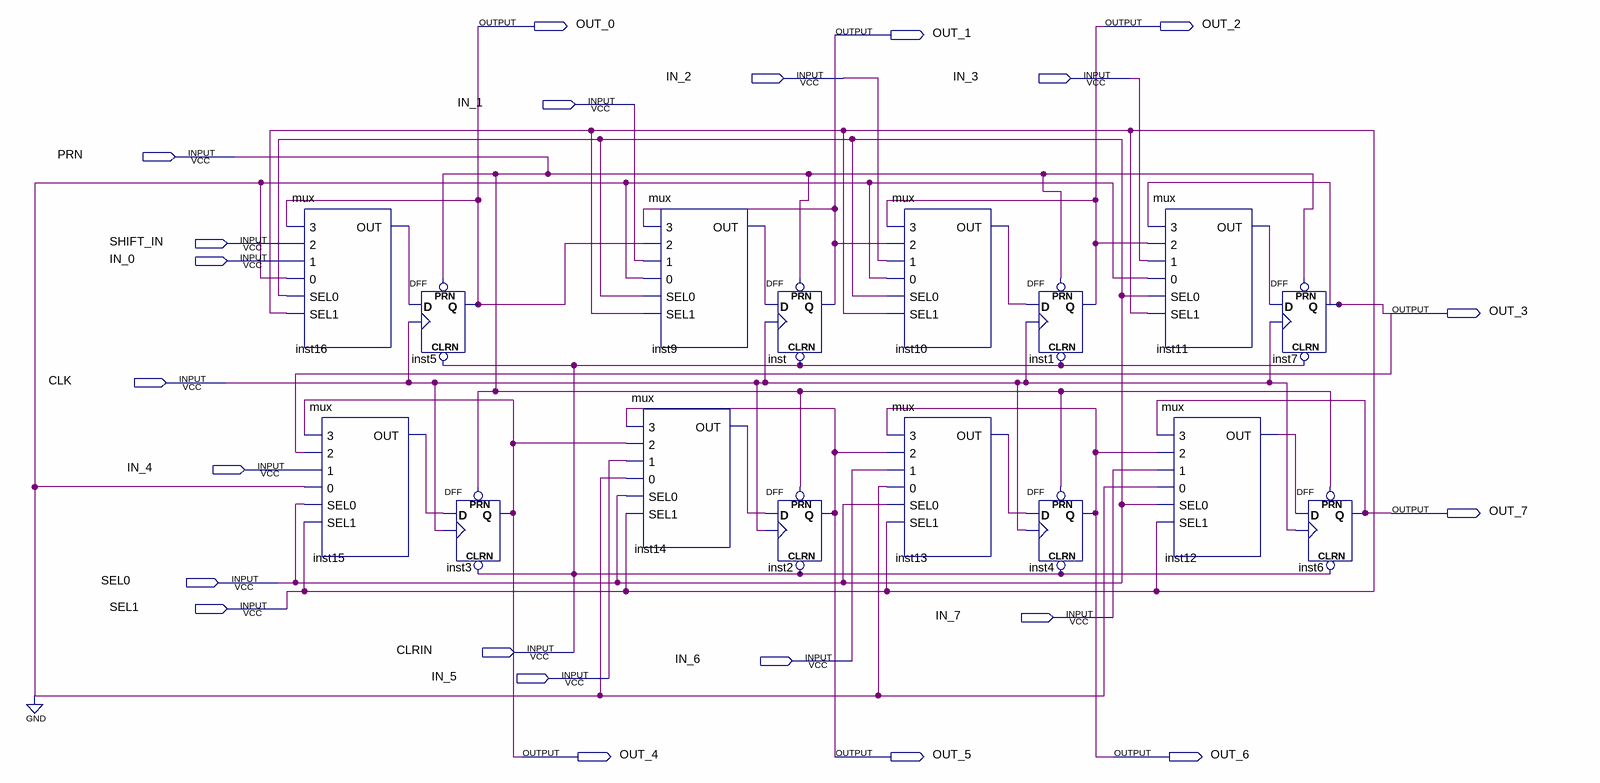
[diagram p0: schematic sheet]
// Quartus schematic 8b_reg.bdf as structural Verilog: 16 symbols, 22 pins
module \8b_reg  (
  input  IN_2,
  input  IN_3,
  input  IN_1,
  input  PRN,
  input  SHIFT_IN,
  input  IN_0,
  input  CLK,
  input  IN_4,
  input  SEL0,
  input  SEL1,
  input  IN_7,
  input  CLRIN,
  input  IN_6,
  input  IN_5,
  output OUT_0,
  output OUT_2,
  output OUT_1,
  output OUT_3,
  output OUT_7,
  output OUT_4,
  output OUT_5,
  output OUT_6
);

  wire inst9_out, inst10_out, inst11_out, inst12_out, inst13_out, inst14_out, inst15_out, inst16_out;

  mux inst16 (.\3 (OUT_0), .\2 (SHIFT_IN), .\1 (IN_0), .\0 (1'b0), .SEL0(SEL0), .SEL1(SEL1), .OUT(inst16_out));
  mux inst15 (.\3 (OUT_4), .\2 (OUT_3), .\1 (IN_4), .\0 (1'b0), .SEL0(SEL0), .SEL1(SEL1), .OUT(inst15_out));
  DFF inst5 (.CLRN(CLRIN), .CLK(CLK), .D(inst16_out), .PRN(PRN), .Q(OUT_0));
  DFF inst3 (.CLRN(CLRIN), .CLK(CLK), .D(inst15_out), .PRN(PRN), .Q(OUT_4));
  mux inst9 (.\3 (OUT_1), .\2 (OUT_0), .\1 (IN_1), .\0 (1'b0), .SEL0(SEL0), .SEL1(SEL1), .OUT(inst9_out));
  mux inst14 (.\3 (OUT_5), .\2 (OUT_4), .\1 (IN_5), .\0 (1'b0), .SEL0(SEL0), .SEL1(SEL1), .OUT(inst14_out));
  DFF inst (.CLRN(CLRIN), .CLK(CLK), .D(inst9_out), .PRN(PRN), .Q(OUT_1));
  DFF inst2 (.CLRN(CLRIN), .CLK(CLK), .D(inst14_out), .PRN(PRN), .Q(OUT_5));
  mux inst10 (.\3 (OUT_2), .\2 (OUT_1), .\1 (IN_2), .\0 (1'b0), .SEL0(SEL0), .SEL1(SEL1), .OUT(inst10_out));
  mux inst13 (.\3 (OUT_6), .\2 (OUT_5), .\1 (IN_6), .\0 (1'b0), .SEL0(SEL0), .SEL1(SEL1), .OUT(inst13_out));
  DFF inst1 (.CLRN(CLRIN), .CLK(CLK), .D(inst10_out), .PRN(PRN), .Q(OUT_2));
  DFF inst4 (.CLRN(CLRIN), .CLK(CLK), .D(inst13_out), .PRN(PRN), .Q(OUT_6));
  mux inst11 (.\3 (OUT_3), .\2 (OUT_2), .\1 (IN_3), .\0 (1'b0), .SEL0(SEL0), .SEL1(SEL1), .OUT(inst11_out));
  mux inst12 (.\3 (OUT_7), .\2 (OUT_6), .\1 (IN_7), .\0 (1'b0), .SEL0(SEL0), .SEL1(SEL1), .OUT(inst12_out));
  DFF inst7 (.CLRN(CLRIN), .CLK(CLK), .D(inst11_out), .PRN(PRN), .Q(OUT_3));
  DFF inst6 (.CLRN(CLRIN), .CLK(CLK), .D(inst12_out), .PRN(PRN), .Q(OUT_7));
endmodule
